# Altium schematic sheet Common_Sensor_Box.SchDoc
size A4
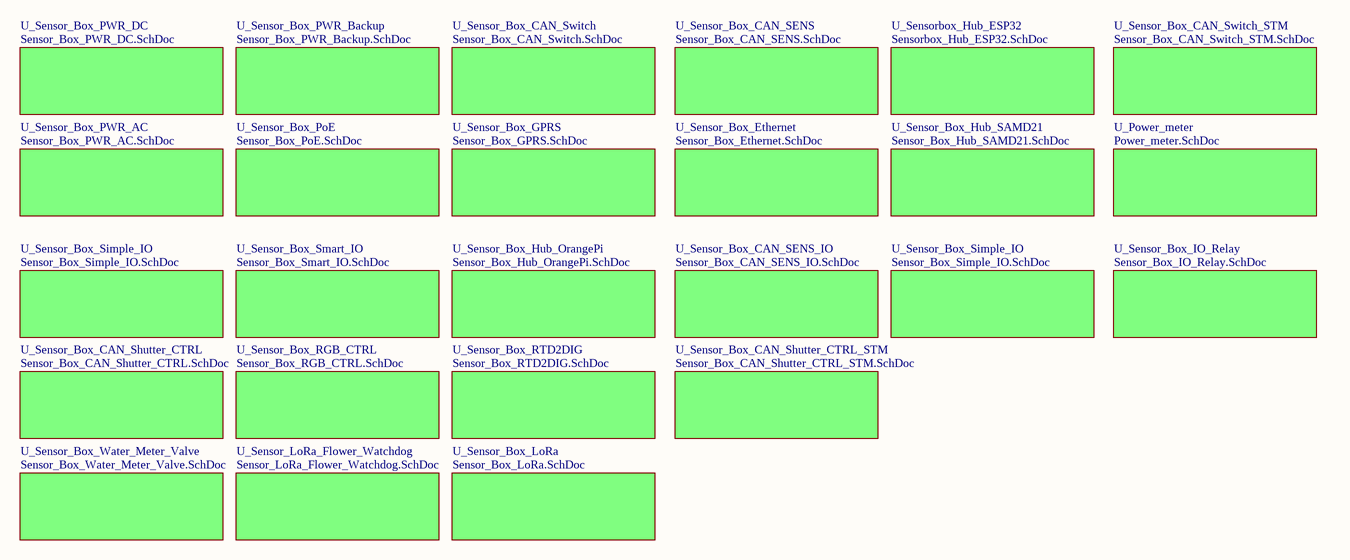
[diagram p0: Common_Sensor_Box.SchDoc]

## Sub-sheets
U_Power_meter = Power_meter.SchDoc: no entries
U_Sensor_Box_CAN_SENS = Sensor_Box_CAN_SENS.SchDoc: no entries
U_Sensor_Box_CAN_SENS_IO = Sensor_Box_CAN_SENS_IO.SchDoc: no entries
U_Sensor_Box_CAN_Shutter_CTRL = Sensor_Box_CAN_Shutter_CTRL.SchDoc: no entries
U_Sensor_Box_CAN_Shutter_CTRL_STM = Sensor_Box_CAN_Shutter_CTRL_STM.SchDoc: no entries
U_Sensor_Box_CAN_Switch = Sensor_Box_CAN_Switch.SchDoc: no entries
U_Sensor_Box_CAN_Switch_STM = Sensor_Box_CAN_Switch_STM.SchDoc: no entries
U_Sensor_Box_Ethernet = Sensor_Box_Ethernet.SchDoc: no entries
U_Sensor_Box_GPRS = Sensor_Box_GPRS.SchDoc: no entries
U_Sensor_Box_Hub_OrangePi = Sensor_Box_Hub_OrangePi.SchDoc: no entries
U_Sensor_Box_Hub_SAMD21 = Sensor_Box_Hub_SAMD21.SchDoc: no entries
U_Sensor_Box_IO_Relay = Sensor_Box_IO_Relay.SchDoc: no entries
U_Sensor_Box_LoRa = Sensor_Box_LoRa.SchDoc: no entries
U_Sensor_Box_PoE = Sensor_Box_PoE.SchDoc: no entries
U_Sensor_Box_PWR_AC = Sensor_Box_PWR_AC.SchDoc: no entries
U_Sensor_Box_PWR_Backup = Sensor_Box_PWR_Backup.SchDoc: no entries
U_Sensor_Box_PWR_DC = Sensor_Box_PWR_DC.SchDoc: no entries
U_Sensor_Box_RGB_CTRL = Sensor_Box_RGB_CTRL.SchDoc: no entries
U_Sensor_Box_RTD2DIG = Sensor_Box_RTD2DIG.SchDoc: no entries
U_Sensor_Box_Simple_IO = Sensor_Box_Simple_IO.SchDoc: no entries
U_Sensor_Box_Simple_IO = Sensor_Box_Simple_IO.SchDoc: no entries
U_Sensor_Box_Smart_IO = Sensor_Box_Smart_IO.SchDoc: no entries
U_Sensor_Box_Water_Meter_Valve = Sensor_Box_Water_Meter_Valve.SchDoc: no entries
U_Sensor_LoRa_Flower_Watchdog = Sensor_LoRa_Flower_Watchdog.SchDoc: no entries
U_Sensorbox_Hub_ESP32 = Sensorbox_Hub_ESP32.SchDoc: no entries